# Altium schematic sheet Boost_Schem.SchDoc
size A4; SheetNumber: 1; SheetTotal: 1
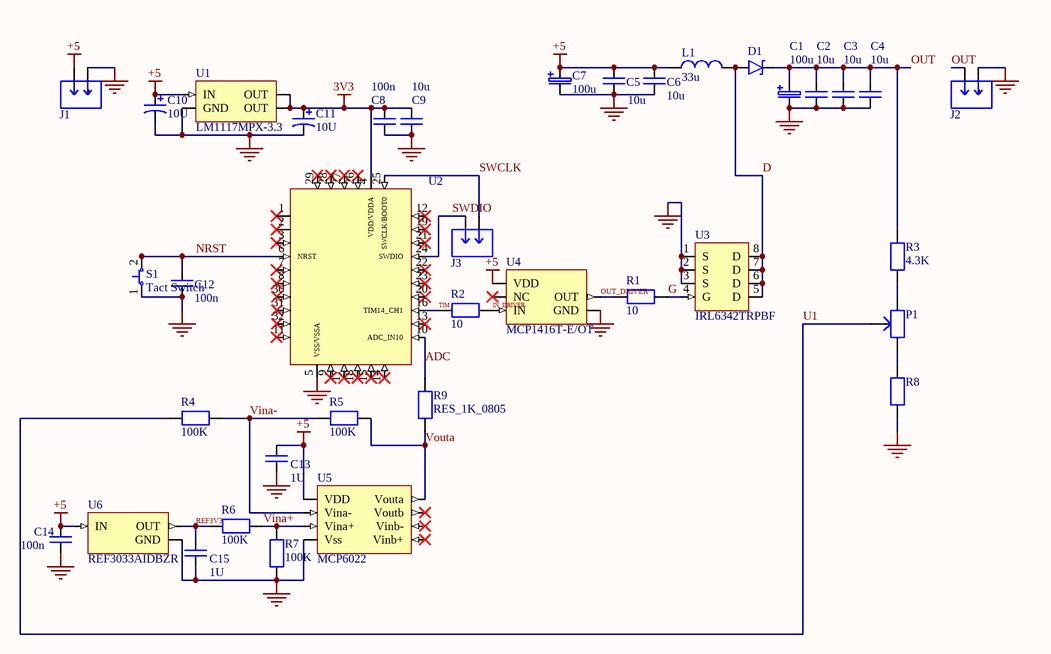
[diagram p0: Boost_Schem.SchDoc]

## Parts
C1  100u  [CAP_100UF_ALUM]
C2  10u  [CAP_10uF_1206_CER - duplicate]
C3  10u  [CAP_10uF_1206_CER - duplicate]
C4  10u  [CAP_10uF_1206_CER - duplicate]
C5  10u  [CAP_10uF_1206_CER - duplicate]
C6  10u  [CAP_10uF_1206_CER - duplicate]
C7  100u  [CAP_100UF_ALUM]
C8  100n  [CAP_100N_0805_CER]
C9  10u  [CAP_10uF_1206_CER - duplicate]
C10  10U  [CAP_10U_1206_TANTAL]
C11  10U  [CAP_10U_1206_TANTAL]
C12  100n  [CAP_100N_0805_CER]
C13  1U  [CAP_1U_0805_CER]
C14  100n  [CAP_100N_0805_CER]
C15  1U  [CAP_1U_0805_CER]
D1  SCHOTTKY_2A_60V  [SCHOTKY]  (value not drawn)
J1  LISTWA ZACISKOWA DO DRUKU  [ZACISK]  (value not drawn)
J2  LISTWA ZACISKOWA DO DRUKU  [ZACISK]  (value not drawn)
J3  ZŁĄCZE KOŁOWE  [SWD]  (value not drawn)
L1  33u  [CEWKA]
P1  2K  [POTENCJOMETR]  (value not drawn)
R1  10  [RES_10_0805]
R2  10  [RES_10_0805]
R3  4.3K  [RES_4K3_0805]
R4  100K  [RES_100K_0805]
R5  100K  [RES_100K_0805]
R6  100K  [RES_100K_0805]
R7  100K  [RES_100K_0805]
R8  51  [REZ_51_OHM_0805]  (value not drawn)
R9  RES_1K_0805  [RES_1K_0805]
S1  Tact Switch  [SWITCH]
U1  LM1117MPX-3.3  [LDO]
U2  STM32G030K8T6  [Quad32]  (value not drawn)
U3  IRL6342TRPBF  [TRANZYSTOR]
U4  MCP1416T-E/OT  [DRIVER]
U5  MCP6022  [WZMACNIACZ]
U6  REF3033AIDBZR  [REFF]

## Nets
3V3: C8.2 C9.1 C11.2 U1.2(OUT) U1.4(OUT) U2.4(VDD/VDDA)
+5: C5.1 C6.1 C7.2 C10.2 C13.2 C14.2 J1.1(+) L1.1 U1.3(IN) U4.2(VDD) U5.8(VDD) U6.1(IN)
GND: C1.1 C2.2 C3.2 C4.2 C5.2 C6.2 C7.1 C8.1 C9.2 C10.1 C11.1 C12.1 C13.1 C14.1 C15.1 J1.2(-) J2.2(-) R7.1 R8.1 S1.1 U1.1(GND) U2.5(VSS/VSSA) U3.1(S) U3.2(S) U3.3(S) U4.4(GND) U5.4(Vss) U6.3(GND)
ADC: R9.2 U2.10(ADC_IN10)
D: D1.1 L1.2 U3.5(D) U3.6(D) U3.7(D) U3.8(D)
G: R1.2 U3.4(G)
IN_DRIVER: R2.2 U4.3(IN)
NRST: C12.2 S1.2 U2.6(NRST)
OUT: C1.2 C2.1 C3.1 C4.1 D1.2 J2.1(+) R3.2
OUT_DRIVER: R1.1 U4.5(OUT)
REF3V3: C15.2 R6.1 U6.2(OUT)
SWCLK: J3.1(SWCLK) U2.25(SWCLK/BOOT0)
SWDIO: J3.2(SWDIO) U2.24(SWDIO)
TIM: R2.1 U2.16(TIM14_CH1)
U1: P1.2 R4.2
Vina+: R6.2 R7.2 U5.3(Vina+)
Vina-: R4.1 R5.2 U5.2(Vina-)
Vouta: R5.1 R9.1 U5.1(Vouta)
NetP1_1: P1.1 R3.1
NetP1_3: P1.3 R8.2

Not connected (* = marked no-connect by the designer): U2 1* 2* 3* 7* 8* 9* 11* 12* 13* 14* 15* 17* 18* 19* 20* 21* 22* 23* 26* 27* 28* 29* 30* 31* 32*; U4 1(NC)*; U5 5(Vinb+)* 6(Vinb-)* 7(Voutb)*

## Library data of the parts
C1 C7 = CAP_100UF_63V_ALUM: SMD Aluminum Electrolytic Capacitor SMD, D10xL10.2mm 100μF ±20% 63V 2000Hrs@105℃ 400mA 350mΩ; Manufacturer: Panasonic; Manufacturer Part Number: EEEFK1J101P; Manufacturer Lifecycle Status: ACTIVE; Part Series: FK; Dielectric Material: Aluminium; Dissipation Factor: 8%; Leakage Current: 63µA; Life (Hours): 2000hours; Polarity: Polar; Supplier: RS; Supplier Part Number: 7083623P; RoHS: Compliant; Category: Aluminum Electrolytic Capacitors; Stock: 1435; Value: 100µF; Case/Package: Radial; Contact Plating: Tin; Country of Origin: Japan, Malaysia; Diameter: 10mm; Export Control Classification Number (ECCN) Code: EAR99; ESR (Equivalent Series Resistance): 350mΩ; Height: 10.2mm; Height - Seated (Max): 10.4902mm; Harmonized Tariff Schedule (HTS) Code: 8532.22.00.20; Impedance: 350mΩ; Introduction Date: 2004-08-25; Lead Free: Lead Free; Length: 10.2mm; Lifecycle Status: Production; Material: Aluminium; Max Operating Temperature: 105°C; Min Operating Temperature: -55°C; Mounting Technology: Surface Mount; Pins: 2; Number of Terminals: 2; Packaging: Cut Tape; Radiation Hardening: No; REACH SVHC: Yes; Ripple Current: 400mA; Ripple Current (AC): 400mA; Schedule B: 8532220020, 8532220020|8532220020|8532220020|8532220020|8532220020|8532220020|8532220020|8532220020|8532220020|8532220020|8532220020|8532220020|8532220020|8532220020|8532220020|8532220020|8532220020|8532220020|8532220020|8532220020|8532220020|8532220020|8532220020|85; Termination: SMD/SMT; Tolerance: 20%; Voltage: 63V; Voltage Rating: 63V; Voltage Rating (AC): 63V; Voltage Rating (DC): 63V; Width: 10.3mm; ComponentLink1URL: https://datasheet.octopart.com:443/EEEFK1J101P-Panasonic-datasheet-62287436.pdf?src-supplier=Farnell; ComponentLink1Description: https://datasheet.octopart.com:443/EEEFK1J101P-Panasonic-datasheet-62287436.pdf?src-supplier=Farnell; ComponentLink2URL: https://datasheet.octopart.com:443/EEEFK1J101P-Panasonic-datasheet-5318435.pdf?src-supplier=Farnell; ComponentLink2Description: https://datasheet.octopart.com:443/EEEFK1J101P-Panasonic-datasheet-5318435.pdf?src-supplier=Farnell; ComponentLink3URL: https://datasheet.octopart.com:443/EEEFK1J101P-Panasonic-datasheet-5316599.pdf?src-supplier=Farnell; ComponentLink3Description: https://datasheet.octopart.com:443/EEEFK1J101P-Panasonic-datasheet-5316599.pdf?src-supplier=Farnell; ComponentLink4URL: https://datasheet.octopart.com:443/EEEFK1J101P-Panasonic-datasheet-5390910.pdf?src-supplier=Farnell; ComponentLink4Description: https://datasheet.octopart.com:443/EEEFK1J101P-Panasonic-datasheet-5390910.pdf?src-supplier=Farnell; ComponentLink5URL: https://datasheet.octopart.com:443/EEEFK1J101P-Panasonic-datasheet-7550061.pdf?src-supplier=Farnell; ComponentLink5Description: https://datasheet.octopart.com:443/EEEFK1J101P-Panasonic-datasheet-7550061.pdf?src-supplier=Farnell; ComponentLink6URL: https://datasheet.octopart.com:443/EEEFK1J101P-Panasonic-datasheet-1770.pdf?src-supplier=Farnell; ComponentLink6Description: https://datasheet.octopart.com:443/EEEFK1J101P-Panasonic-datasheet-1770.pdf?src-supplier=Farnell; ComponentLink7URL: https://datasheet.octopart.com:443/EEEFK1J101P-Panasonic-datasheet-1290.pdf?src-supplier=Farnell; ComponentLink7Description: https://datasheet.octopart.com:443/EEEFK1J101P-Panasonic-datasheet-1290.pdf?src-supplier=Farnell; ComponentLink8URL: https://datasheet.octopart.com:443/EEEFK1J101P-Panasonic-datasheet-2601.pdf?src-supplier=Farnell; ComponentLink8Description: https://datasheet.octopart.com:443/EEEFK1J101P-Panasonic-datasheet-2601.pdf?src-supplier=Farnell; ComponentLink9URL: https://datasheet.octopart.com:443/EEEFK1J101P-Panasonic-datasheet-122249.pdf?src-supplier=Farnell; ComponentLink9Description: https://datasheet.octopart.com:443/EEEFK1J101P-Panasonic-datasheet-122249.pdf?src-supplier=Farnell; ComponentLink10URL: https://datasheet.octopart.com:443/EEEFK1J101P-Panasonic-datasheet-4056.pdf?src-supplier=Farnell; ComponentLink10Description: https://datasheet.octopart.com:443/EEEFK1J101P-Panasonic-datasheet-4056.pdf?src-supplier=Farnell; ComponentLink11URL: https://datasheet.octopart.com:443/EEEFK1J101P-Panasonic-datasheet-169278531.pdf?src-supplier=IHS; ComponentLink11Description: https://datasheet.octopart.com:443/EEEFK1J101P-Panasonic-datasheet-169278531.pdf?src-supplier=IHS; ComponentLink12URL: https://datasheet.octopart.com:443/EEEFK1J101P-Panasonic-datasheet-8161.pdf?src-supplier=Newark; ComponentLink12Description: https://datasheet.octopart.com:443/EEEFK1J101P-Panasonic-datasheet-8161.pdf?src-supplier=Newark; ComponentLink13URL: https://datasheet.octopart.com:443/EEEFK1J101P-Panasonic-datasheet-61627622.pdf?src-supplier=Newark; ComponentLink13Description: https://datasheet.octopart.com:443/EEEFK1J101P-Panasonic-datasheet-61627622.pdf?src-supplier=Newark; ComponentLink14URL: https://datasheet.octopart.com:443/EEEFK1J101P-Panasonic-datasheet-8852369.pdf?src-supplier=Newark; ComponentLink14Description: https://datasheet.octopart.com:443/EEEFK1J101P-Panasonic-datasheet-8852369.pdf?src-supplier=Newark; ComponentLink15URL: https://datasheet.octopart.com:443/EEEFK1J101P-Panasonic-datasheet-8712906.pdf?src-supplier=Newark; ComponentLink15Description: https://datasheet.octopart.com:443/EEEFK1J101P-Panasonic-datasheet-8712906.pdf?src-supplier=Newark; ComponentLink16URL: https://datasheet.octopart.com:443/EEEFK1J101P-Panasonic-datasheet-13278598.pdf?src-supplier=Newark; ComponentLink16Description: https://datasheet.octopart.com:443/EEEFK1J101P-Panasonic-datasheet-13278598.pdf?src-supplier=Newark; ComponentLink17URL: https://datasheet.octopart.com:443/EEE-FK1J101P-Panasonic-datasheet-22087609.pdf?src-supplier=Newark; ComponentLink17Description: https://datasheet.octopart.com:443/EEE-FK1J101P-Panasonic-datasheet-22087609.pdf?src-supplier=Newark; ComponentLink18URL: https://datasheet.octopart.com:443/EEEFK1J101P-Panasonic-datasheet-11546739.pdf?src-supplier=Electro+Sonic; ComponentLink18Description: https://datasheet.octopart.com:443/EEEFK1J101P-Panasonic-datasheet-11546739.pdf?src-supplier=Electro+Sonic; ComponentLink19URL: https://datasheet.octopart.com:443/EEEFK1J101P-Panasonic-datasheet-13266987.pdf?src-supplier=RS+(Formerly+Allied+Electronics); ComponentLink19Description: https://datasheet.octopart.com:443/EEEFK1J101P-Panasonic-datasheet-13266987.pdf?src-supplier=RS+(Formerly+Allied+Electronics); ComponentLink20URL: https://datasheet.octopart.com:443/EEE-FK1J101P-Panasonic-datasheet-150469824.pdf?src-supplier=Master+Electronics; ComponentLink20Description: https://datasheet.octopart.com:443/EEE-FK1J101P-Panasonic-datasheet-150469824.pdf?src-supplier=Master+Electronics; ComponentLink21URL: https://datasheet.octopart.com:443/EEEFK1J101P-Panasonic-datasheet-8854493.pdf?src-supplier=Future+Electronics; ComponentLink21Description: https://datasheet.octopart.com:443/EEEFK1J101P-Panasonic-datasheet-8854493.pdf?src-supplier=Future+Electronics; ComponentLink22URL: https://datasheet.octopart.com:443/EEEFK1J101P-Panasonic-datasheet-8711795.pdf?src-supplier=Future+Electronics; ComponentLink22Description: https://datasheet.octopart.com:443/EEEFK1J101P-Panasonic-datasheet-8711795.pdf?src-supplier=Future+Electronics; ComponentLink23URL: https://datasheet.octopart.com:443/EEEFK1J101P-Panasonic-datasheet-5313801.pdf?src-supplier=Future+Electronics; ComponentLink23Description: https://datasheet.octopart.com:443/EEEFK1J101P-Panasonic-datasheet-5313801.pdf?src-supplier=Future+Electronics; ComponentLink24URL: https://datasheet.octopart.com:443/EEEFK1J101P-Panasonic-datasheet-7555708.pdf?src-supplier=Jameco; ComponentLink24Description: https://datasheet.octopart.com:443/EEEFK1J101P-Panasonic-datasheet-7555708.pdf?src-supplier=Jameco; ComponentLink25URL: https://sigma.octopart.com:443/150570760/technical_drawing/Panasonic-EEEFK1J101P.pdf?src-supplier=Panasonic+SCT; ComponentLink25Description: https://sigma.octopart.com:443/150570760/technical_drawing/Panasonic-EEEFK1J101P.pdf?src-supplier=Panasonic+SCT; ComponentLink26URL: https://datasheet.octopart.com:443/EEEFK1J101P-Panasonic-datasheet-136531309.pdf?src-supplier=TME; ComponentLink26Description: https://datasheet.octopart.com:443/EEEFK1J101P-Panasonic-datasheet-136531309.pdf?src-supplier=TME
C2-C4 C6 C9 = CAP_10uF_1206_CER: CAP CER 10UF 50V X7R 1206; Manufacturer: Samsung Electro-Mechanics; Manufacturer Part Number: CL31B106KBHNNNE; Value: 10µF; Dielectric Material: Ceramic; Tolerance: 10%; Supplier: Avnet; Supplier Part Number: CL31B106KBHNNNE; RoHS: Compliant; Category: Ceramic Capacitors; Stock: 874000; Pricing: 2000=0,04677, 4000=0,04637, 8000=0,04557, 16000=0,04478, 32000=0,04398 (USD); Case/Package: 1206; Case Code (Imperial): 1206; Case Code (Metric): 3216; China RoHS: Compliant; Country of Origin: Mainland China, Philippines, South Korea; Dielectric: X7R; Export Control Classification Number (ECCN) Code: EAR99; Height: 1.8mm; Harmonized Tariff Schedule (HTS) Code: 8532.24.00.20; Introduction Date: 2014-09-18; Lead Free: Lead Free; Length: 3.2mm; Lifecycle Status: Production; Material: Ceramic; Max Operating Temperature: 125°C; Min Operating Temperature: -55°C; Mounting Technology: Surface Mount; Number of Terminals: 2; Packaging: Tape & Reel (TR); REACH SVHC: Yes; Schedule B: 8532240020, 8532240020|8532240020|8532240020|8532240020|8532240020; Thickness: 1.8034mm; Voltage Rating: 50V; Voltage Rating (DC): 50V; Width: 1.6mm; ComponentLink1URL: https://datasheet.octopart.com:443/CL31B106KBHNNNE-Samsung-Electro-Mechanics-datasheet-137256395.pdf?src-supplier=Upverter; ComponentLink1Description: https://datasheet.octopart.com:443/CL31B106KBHNNNE-Samsung-Electro-Mechanics-datasheet-137256395.pdf?src-supplier=Upverter; ComponentLink2URL: https://datasheet.octopart.com:443/CL31B106KBHNNNE-Samsung-Electro-Mechanics-datasheet-149066874.pdf?src-supplier=Future+Electronics; ComponentLink2Description: https://datasheet.octopart.com:443/CL31B106KBHNNNE-Samsung-Electro-Mechanics-datasheet-149066874.pdf?src-supplier=Future+Electronics; ComponentLink3URL: https://datasheet.octopart.com:443/CL31B106KBHNNNE-Samsung-Electro-Mechanics-datasheet-67374631.pdf?src-supplier=Future+Electronics; ComponentLink3Description: https://datasheet.octopart.com:443/CL31B106KBHNNNE-Samsung-Electro-Mechanics-datasheet-67374631.pdf?src-supplier=Future+Electronics; ComponentLink4URL: https://datasheet.octopart.com:443/CL31B106KBHNNNE-Samsung-Electro-Mechanics-datasheet-136482622.pdf?src-supplier=Newark; ComponentLink4Description: https://datasheet.octopart.com:443/CL31B106KBHNNNE-Samsung-Electro-Mechanics-datasheet-136482622.pdf?src-supplier=Newark; ComponentLink5URL: https://datasheet.octopart.com/CL31B106KBHNNNE-Samsung-Electro-Mechanics-datasheet-97040617.pdf; ComponentLink5Description: https://datasheet.octopart.com/CL31B106KBHNNNE-Samsung-Electro-Mechanics-datasheet-97040617.pdf; ComponentLink6URL: https://datasheet.octopart.com/CL31B106KBHNNNE-Samsung-Electro-Mechanics-datasheet-8324245.pdf; ComponentLink6Description: https://datasheet.octopart.com/CL31B106KBHNNNE-Samsung-Electro-Mechanics-datasheet-8324245.pdf; ComponentLink7URL: https://datasheet.octopart.com:443/CL31B106KBHNNNE-Samsung-Electro-Mechanics-datasheet-110617700.pdf?src-supplier=LCSC; ComponentLink7Description: https://datasheet.octopart.com:443/CL31B106KBHNNNE-Samsung-Electro-Mechanics-datasheet-110617700.pdf?src-supplier=LCSC; ComponentLink8URL: https://datasheet.octopart.com:443/CL31B106KBHNNNE-Samsung-datasheet-59220082.pdf?src-supplier=TME; ComponentLink8Description: https://datasheet.octopart.com:443/CL31B106KBHNNNE-Samsung-datasheet-59220082.pdf?src-supplier=TME
C5 = CAP_10uF_1206_CER: Manufacturer: Samsung Electro-Mechanics; Manufacturer Part Number: CL31B106KBHNNNE; Value: 10µF; Dielectric: X7R; Dielectric Material: Ceramic; Tolerance: 10%; Voltage Rating: 50V; Supplier: Avnet; Supplier Part Number: CL31B106KBHNNNE; RoHS: Compliant; Category: Ceramic Capacitors; Stock: 874000; Pricing: 2000=0,04677, 4000=0,04637, 8000=0,04557, 16000=0,04478, 32000=0,04398 (USD); Case/Package: 1206; Case Code (Imperial): 1206; Case Code (Metric): 3216; China RoHS: Compliant; Country of Origin: Mainland China, Philippines, South Korea; Export Control Classification Number (ECCN) Code: EAR99; Height: 1.8mm; Harmonized Tariff Schedule (HTS) Code: 8532.24.00.20; Introduction Date: 2014-09-18; Lead Free: Lead Free; Length: 3.2mm; Lifecycle Status: Production; Material: Ceramic; Max Operating Temperature: 125°C; Min Operating Temperature: -55°C; Mounting Technology: Surface Mount; Number of Terminals: 2; Packaging: Tape & Reel (TR); REACH SVHC: Yes; Schedule B: 8532240020, 8532240020|8532240020|8532240020|8532240020|8532240020; Thickness: 1.8034mm; Voltage Rating (DC): 50V; Width: 1.6mm; ComponentLink1URL: https://datasheet.octopart.com:443/CL31B106KBHNNNE-Samsung-Electro-Mechanics-datasheet-137256395.pdf?src-supplier=Upverter; ComponentLink1Description: https://datasheet.octopart.com:443/CL31B106KBHNNNE-Samsung-Electro-Mechanics-datasheet-137256395.pdf?src-supplier=Upverter; ComponentLink2URL: https://datasheet.octopart.com:443/CL31B106KBHNNNE-Samsung-Electro-Mechanics-datasheet-149066874.pdf?src-supplier=Future+Electronics; ComponentLink2Description: https://datasheet.octopart.com:443/CL31B106KBHNNNE-Samsung-Electro-Mechanics-datasheet-149066874.pdf?src-supplier=Future+Electronics; ComponentLink3URL: https://datasheet.octopart.com:443/CL31B106KBHNNNE-Samsung-Electro-Mechanics-datasheet-67374631.pdf?src-supplier=Future+Electronics; ComponentLink3Description: https://datasheet.octopart.com:443/CL31B106KBHNNNE-Samsung-Electro-Mechanics-datasheet-67374631.pdf?src-supplier=Future+Electronics; ComponentLink4URL: https://datasheet.octopart.com:443/CL31B106KBHNNNE-Samsung-Electro-Mechanics-datasheet-136482622.pdf?src-supplier=Newark; ComponentLink4Description: https://datasheet.octopart.com:443/CL31B106KBHNNNE-Samsung-Electro-Mechanics-datasheet-136482622.pdf?src-supplier=Newark; ComponentLink5URL: https://datasheet.octopart.com/CL31B106KBHNNNE-Samsung-Electro-Mechanics-datasheet-97040617.pdf; ComponentLink5Description: https://datasheet.octopart.com/CL31B106KBHNNNE-Samsung-Electro-Mechanics-datasheet-97040617.pdf; ComponentLink6URL: https://datasheet.octopart.com/CL31B106KBHNNNE-Samsung-Electro-Mechanics-datasheet-8324245.pdf; ComponentLink6Description: https://datasheet.octopart.com/CL31B106KBHNNNE-Samsung-Electro-Mechanics-datasheet-8324245.pdf; ComponentLink7URL: https://datasheet.octopart.com:443/CL31B106KBHNNNE-Samsung-Electro-Mechanics-datasheet-110617700.pdf?src-supplier=LCSC; ComponentLink7Description: https://datasheet.octopart.com:443/CL31B106KBHNNNE-Samsung-Electro-Mechanics-datasheet-110617700.pdf?src-supplier=LCSC; ComponentLink8URL: https://datasheet.octopart.com:443/CL31B106KBHNNNE-Samsung-datasheet-59220082.pdf?src-supplier=TME; ComponentLink8Description: https://datasheet.octopart.com:443/CL31B106KBHNNNE-Samsung-datasheet-59220082.pdf?src-supplier=TME
C8 C12 C14 = CAP_100nF_0805_CER
C10 C11 = CAP_10uF_0805_TANTALUM
C13 C15 = CAP_1uF_0805_CER
D1 = SCHOTTKY_2A_60V: Dioda: prostownicza Schottky; SMA; SMD; 60V; 2A; rolka,taśma; Manufacturer: STMicroelectronics; Manufacturer Part Number: STPS2L60A; Element Configuration: Single; Forward Voltage: 550mV; Max Forward Surge Current (Ifsm): 75A; Max Junction Temperature (Tj): 150°C; Max Reverse Leakage Current: 100µA; Number of Elements: 1; Polarity: Standard; Supplier: RS; Supplier Part Number: 249218P; RoHS: Compliant; Category: Schottky Diodes; Stock: 4660; Average Rectified Current: 2A; Case/Package: SMA; China RoHS: Non-Compliant; Contact Plating: Tin; Current Rating: 2A; Forward Current: 2A; Height: 2.65mm; Lead Free: Lead Free; Length: 4.6mm; Lifecycle Status: Production; Max Operating Temperature: 150°C; Max Output current: 2A; Max Repetitive Reverse Voltage (Vrrm): 60V; Max Reverse Voltage (DC): 60V; Max Surge Current: 75A; Min Operating Temperature: -65°C; Mounting Technology: Surface Mount; Pins: 2; Number of Terminals: 2; Output Current: 2A; Packaging: Tape and Reel; Peak Non-Repetitive Surge Current: 75A; Peak Reverse Current: 100µA; Radiation Hardening: No; REACH SVHC: No; Reverse Standoff Voltage: 60V; Schedule B: 8541100080, 8541100080|8541100080|8541100080|8541100080|8541100080, 8541100080|8541100080|8541100080|8541100080|8541100080|8541100080, 8541100080|8541100080|8541100080|8541100080|8541100080|8541100080|8541100080|8541100080|8541100080|8541100080|8541100080|8541100080|8541100080|8541100080|8541100080|8541100080|8541100080|8541100080|8541100080|8541100080|8541100080|8541100080|8541100080|85; Voltage Rating (DC): 60V; Weight: 4.535924g; Width: 2.95mm; ComponentLink1URL: https://datasheet.octopart.com:443/STPS2L60A-STMicroelectronics-datasheet-10540977.pdf?src-supplier=element14+APAC; ComponentLink1Description: https://datasheet.octopart.com:443/STPS2L60A-STMicroelectronics-datasheet-10540977.pdf?src-supplier=element14+APAC; ComponentLink2URL: https://datasheet.octopart.com:443/STPS2L60A-STMicroelectronics-datasheet-62337125.pdf?src-supplier=Newark; ComponentLink2Description: https://datasheet.octopart.com:443/STPS2L60A-STMicroelectronics-datasheet-62337125.pdf?src-supplier=Newark; ComponentLink3URL: https://datasheet.octopart.com:443/STPS2L60A-STMicroelectronics-datasheet-633754.pdf?src-supplier=element14; ComponentLink3Description: https://datasheet.octopart.com:443/STPS2L60A-STMicroelectronics-datasheet-633754.pdf?src-supplier=element14; ComponentLink4URL: https://datasheet.octopart.com:443/STPS2L60A-STMicroelectronics-datasheet-8474236.pdf?src-supplier=Farnell; ComponentLink4Description: https://datasheet.octopart.com:443/STPS2L60A-STMicroelectronics-datasheet-8474236.pdf?src-supplier=Farnell; ComponentLink5URL: https://datasheet.octopart.com:443/STPS2L60A-STMicroelectronics-datasheet-7700.pdf?src-supplier=DigiKey; ComponentLink5Description: https://datasheet.octopart.com:443/STPS2L60A-STMicroelectronics-datasheet-7700.pdf?src-supplier=DigiKey; ComponentLink6URL: https://datasheet.octopart.com:443/STPS2L60A-STMicroelectronics-datasheet-136784893.pdf?src-supplier=TME; ComponentLink6Description: https://datasheet.octopart.com:443/STPS2L60A-STMicroelectronics-datasheet-136784893.pdf?src-supplier=TME; ComponentLink7URL: https://datasheet.octopart.com:443/STPS2L60A-STMicroelectronics-datasheet-107242832.pdf?src-supplier=TME; ComponentLink7Description: https://datasheet.octopart.com:443/STPS2L60A-STMicroelectronics-datasheet-107242832.pdf?src-supplier=TME; ComponentLink8URL: https://datasheet.octopart.com:443/STPS2L60A-STMicroelectronics-datasheet-14054748.pdf?src-supplier=iiiC; ComponentLink8Description: https://datasheet.octopart.com:443/STPS2L60A-STMicroelectronics-datasheet-14054748.pdf?src-supplier=iiiC; ComponentLink9URL: https://datasheet.octopart.com:443/STPS2L60A-STMicroelectronics-datasheet-9806417.pdf?src-supplier=RS+(Formerly+Allied+Electronics); ComponentLink9Description: https://datasheet.octopart.com:443/STPS2L60A-STMicroelectronics-datasheet-9806417.pdf?src-supplier=RS+(Formerly+Allied+Electronics)
J1 J2 = ZACISK
J3 = ZŁĄCZE KOŁOWE: Złącze: kołkowe; listwa kołkowa; męskie; PIN: 2; THT; BERGSTIK; 1x2
L1 = IND_33uH_3.22A: Dławik: drutowy; SMD; 32,01uH; Ipracy: 3,22A; R: 60mΩ; ±20%; Manufacturer: Eaton; Manufacturer Part Number: DRA127-330-R; Core Material: Ferrite; Current Rating: 3.22A; Value: 32.01µH; Number of Circuits: 1; Saturation Current: 6.22A; Self Resonant Frequency: 100kHz; Shielding: Yes; Supplier: DigiKey; Supplier Part Number: 283-3593-1-ND; RoHS: Compliant; Category: Fixed Inductors; Stock: 194; Pricing: 1=2,18, 10=1,796, 25=1,662, 50=1,5668, 100=1,4773 (USD); Case/Package: Nonstandard; Composition: Wirewound; Country of Origin: Philippines; DC Resistance (DCR): 60mΩ; Depth: 12.5mm; Export Control Classification Number (ECCN) Code: EAR99; Height: 8mm; Height - Seated (Max): 8.001mm; Harmonized Tariff Schedule (HTS) Code: 8504.50.80.00; Inductance Tolerance: 20%; Introduction Date: 2006-11-16; Lead Free: Lead Free; Lead Pitch: 7.5mm; Length: 12.5mm; Lifecycle Status: Production; Max Current Rating: 3.22A; Max DC Current: 3.22A; Max Operating Temperature: 165°C; Military Standard: Not; Min Operating Temperature: -40°C; Mounting Technology: Surface Mount; Pins: 2; Number of Terminals: 2; Packaging: Cut Tape; Radiation Hardening: No; Ratings: AEC-Q200; REACH SVHC: Yes; RMS Current (Irms): 3.22A; Schedule B: 8504500000, 8504500000|8504500000|8504500000|8504500000|8504500000|8504500000|8504500000|8504500000|8504500000|8504500000|8504500000|8504500000|8504500000|8504500000|8504500000|8504500000|8504500000|8504500000|8504500000|8504500000|8504500000|8504500000|8504500000|85; Termination: SMD/SMT; Test Frequency: 100kHz; Tolerance: 20%; Weight: 453.59237mg; Width: 12.5mm; ComponentLink1URL: https://datasheet.octopart.com:443/DRA127-330-R-Eaton-datasheet-137317803.pdf?src-supplier=Master+Electronics; ComponentLink1Description: https://datasheet.octopart.com:443/DRA127-330-R-Eaton-datasheet-137317803.pdf?src-supplier=Master+Electronics; ComponentLink2URL: https://datasheet.octopart.com:443/DRA127-330-R-Eaton-datasheet-613698.pdf?src-supplier=Master+Electronics; ComponentLink2Description: https://datasheet.octopart.com:443/DRA127-330-R-Eaton-datasheet-613698.pdf?src-supplier=Master+Electronics; ComponentLink3URL: https://datasheet.octopart.com:443/DRA127-330-R-Eaton-datasheet-62296927.pdf?src-supplier=Master+Electronics; ComponentLink3Description: https://datasheet.octopart.com:443/DRA127-330-R-Eaton-datasheet-62296927.pdf?src-supplier=Master+Electronics; ComponentLink4URL: https://datasheet.octopart.com:443/DRA127-330-R-Eaton-datasheet-137317933.pdf?src-supplier=Master+Electronics; ComponentLink4Description: https://datasheet.octopart.com:443/DRA127-330-R-Eaton-datasheet-137317933.pdf?src-supplier=Master+Electronics; ComponentLink5URL: https://datasheet.octopart.com:443/DRA127-330-R-Cooper-Industries-datasheet-12525441.pdf?src-supplier=Sager+Electronics; ComponentLink5Description: https://datasheet.octopart.com:443/DRA127-330-R-Cooper-Industries-datasheet-12525441.pdf?src-supplier=Sager+Electronics; ComponentLink6URL: https://datasheet.octopart.com:443/DRA127-330-R-Cooper-Bussmann-datasheet-180236337.pdf?src-supplier=IHS; ComponentLink6Description: https://datasheet.octopart.com:443/DRA127-330-R-Cooper-Bussmann-datasheet-180236337.pdf?src-supplier=IHS
P1 = POTENCJOMETR
R1 R2 = RES_10_0805: Rezystor: thick film; SMD; 0805; 10Ω; 250mW; ±5%; 150V; -55÷125°C
R3 = RES_4.3K_0805: Res Thin Film 0805 4.3K Ohm 0.1% 0.125W ±25ppm/°C Molded SMD Punched Carrier T/R; Manufacturer: Panasonic; Manufacturer Part Number: ERA6AEB432V; Manufacturer Lifecycle Status: ACTIVE; Part Series: Thin Film Chip Resistors, High Reliability Type; Max Power Dissipation: 125mW; Value: 4.3kΩ; Voltage Rating: 100V; Supplier: Farnell; Supplier Part Number: 1670236; RoHS: Compliant; Category: Chip SMD Resistors; Stock: 2679; Case/Package: 0805; Case Code (Imperial): 0805; China RoHS: Non-Compliant; Composition: Thin Film; Contact Plating: Tin; Country of Origin: Japan; Depth: 1.25mm; Export Control Classification Number (ECCN) Code: EAR99; Features: Automotive AEC-Q200; Height: 500µm; Harmonized Tariff Schedule (HTS) Code: 8533.21.00.30; Introduction Date: 2006-05-29; Lead Free: Lead Free; Length: 2mm; Lifecycle Status: Production; Max Operating Temperature: 155°C; Military Standard: Not; Min Operating Temperature: -55°C; Mounting Technology: Surface Mount; Pins: 2; Number of Terminals: 2; Number of Terminations: 2; Packaging: Cut Tape; Power Dissipation: 125mW; Power Rating: 125mW; Radiation Hardening: No; REACH SVHC: Yes; Schedule B: 8533210045, 8533210045|8533210045, 8533210045|8533210045|8533210045, 8533210045|8533210045|8533210045|8533210045; Temperature Coefficient: 25ppm/°C; Termination: SMD/SMT; Tolerance: 0.1%; Voltage Rating (DC): 100V; Weight: 5.499807mg; Width: 1.25mm; Working Voltage: 100V; ComponentLink1URL: https://datasheet.octopart.com:443/ERA6AEB432V-Panasonic-datasheet-181959660.pdf?src-supplier=IHS; ComponentLink1Description: https://datasheet.octopart.com:443/ERA6AEB432V-Panasonic-datasheet-181959660.pdf?src-supplier=IHS; ComponentLink2URL: https://datasheet.octopart.com/ERA6AEB432V-Panasonic-datasheet-62287448.pdf; ComponentLink2Description: https://datasheet.octopart.com/ERA6AEB432V-Panasonic-datasheet-62287448.pdf; ComponentLink3URL: https://datasheet.octopart.com/ERA6AEB432V-Panasonic-datasheet-78375410.pdf; ComponentLink3Description: https://datasheet.octopart.com/ERA6AEB432V-Panasonic-datasheet-78375410.pdf; ComponentLink4URL: https://datasheet.octopart.com:443/ERA6AEB432V-Panasonic-datasheet-8367715.pdf?src-supplier=Newark; ComponentLink4Description: https://datasheet.octopart.com:443/ERA6AEB432V-Panasonic-datasheet-8367715.pdf?src-supplier=Newark; ComponentLink5URL: https://datasheet.octopart.com:443/ERA6AEB432V-Panasonic-datasheet-136531316.pdf?src-supplier=Newark; ComponentLink5Description: https://datasheet.octopart.com:443/ERA6AEB432V-Panasonic-datasheet-136531316.pdf?src-supplier=Newark; ComponentLink6URL: https://datasheet.octopart.com:443/ERA-6AEB432V-Panasonic-datasheet-118567.pdf?src-supplier=element14; ComponentLink6Description: https://datasheet.octopart.com:443/ERA-6AEB432V-Panasonic-datasheet-118567.pdf?src-supplier=element14; ComponentLink7URL: https://datasheet.octopart.com:443/ERA6AEB432V-Panasonic-datasheet-61114971.pdf?src-supplier=Future+Electronics; ComponentLink7Description: https://datasheet.octopart.com:443/ERA6AEB432V-Panasonic-datasheet-61114971.pdf?src-supplier=Future+Electronics; ComponentLink8URL: https://datasheet.octopart.com:443/ERA-6AEB432V-Panasonic-datasheet-12510007.pdf?src-supplier=Future+Electronics; ComponentLink8Description: https://datasheet.octopart.com:443/ERA-6AEB432V-Panasonic-datasheet-12510007.pdf?src-supplier=Future+Electronics; ComponentLink9URL: https://datasheet.octopart.com:443/ERA-6AEB432V-Panasonic-datasheet-11763931.pdf?src-supplier=Future+Electronics; ComponentLink9Description: https://datasheet.octopart.com:443/ERA-6AEB432V-Panasonic-datasheet-11763931.pdf?src-supplier=Future+Electronics; ComponentLink10URL: https://datasheet.octopart.com:443/ERA-6AEB432V-Panasonic-datasheet-5392808.pdf?src-supplier=Future+Electronics; ComponentLink10Description: https://datasheet.octopart.com:443/ERA-6AEB432V-Panasonic-datasheet-5392808.pdf?src-supplier=Future+Electronics; ComponentLink11URL: https://datasheet.octopart.com:443/ERA-6AEB432V-Panasonic-datasheet-154766165.pdf?src-supplier=Master+Electronics; ComponentLink11Description: https://datasheet.octopart.com:443/ERA-6AEB432V-Panasonic-datasheet-154766165.pdf?src-supplier=Master+Electronics; ComponentLink12URL: https://datasheet.octopart.com:443/ERA-6AEB432V-Panasonic-datasheet-10840895.pdf?src-supplier=Arrow+Electronics; ComponentLink12Description: https://datasheet.octopart.com:443/ERA-6AEB432V-Panasonic-datasheet-10840895.pdf?src-supplier=Arrow+Electronics; ComponentLink13URL: https://datasheet.octopart.com:443/ERA-6AEB432V-Panasonic-datasheet-13266200.pdf?src-supplier=Electro+Sonic; ComponentLink13Description: https://datasheet.octopart.com:443/ERA-6AEB432V-Panasonic-datasheet-13266200.pdf?src-supplier=Electro+Sonic; ComponentLink14URL: https://datasheet.octopart.com:443/ERA-6AEB432V-Panasonic-datasheet-33006989.pdf?src-supplier=Electro+Sonic; ComponentLink14Description: https://datasheet.octopart.com:443/ERA-6AEB432V-Panasonic-datasheet-33006989.pdf?src-supplier=Electro+Sonic; ComponentLink15URL: https://datasheet.octopart.com:443/ERA-6AEB432V-Panasonic-datasheet-46744048.pdf?src-supplier=Electro+Sonic; ComponentLink15Description: https://datasheet.octopart.com:443/ERA-6AEB432V-Panasonic-datasheet-46744048.pdf?src-supplier=Electro+Sonic; ComponentLink16URL: https://datasheet.octopart.com:443/ERA6AEB432V-Panasonic-datasheet-188913046.pdf?src-supplier=TME; ComponentLink16Description: https://datasheet.octopart.com:443/ERA6AEB432V-Panasonic-datasheet-188913046.pdf?src-supplier=TME; ComponentLink17URL: https://datasheet.octopart.com:443/ERA6AEB432V-Panasonic-datasheet-182736513.pdf?src-supplier=JRH+Electronics; ComponentLink17Description: https://datasheet.octopart.com:443/ERA6AEB432V-Panasonic-datasheet-182736513.pdf?src-supplier=JRH+Electronics; ComponentLink18URL: https://sigma.octopart.com:443/150570796/technical_drawing/Panasonic-ERA6AEB432V.pdf?src-supplier=Panasonic+SCT; ComponentLink18Description: https://sigma.octopart.com:443/150570796/technical_drawing/Panasonic-ERA6AEB432V.pdf?src-supplier=Panasonic+SCT; ComponentLink19URL: https://datasheet.octopart.com:443/ERA6AEB432V-Panasonic-datasheet-138783076.pdf?src-supplier=Burklin+Elektronik; ComponentLink19Description: https://datasheet.octopart.com:443/ERA6AEB432V-Panasonic-datasheet-138783076.pdf?src-supplier=Burklin+Elektronik; ComponentLink20URL: https://datasheet.octopart.com:443/ERA6AEB432V-Panasonic---ECG-datasheet-15994758.pdf?src-supplier=Farnell; ComponentLink20Description: https://datasheet.octopart.com:443/ERA6AEB432V-Panasonic---ECG-datasheet-15994758.pdf?src-supplier=Farnell
R4 R5 R7 = RES_100K_0805: Rezystor: thin film; precyzyjny; SMD; 0603; 50kΩ; 0,1W; ±0,1%; AR
R6 = RES_100K_0805
R8 = RES_51_0805
U5 = MCP6022: IC: wzmacniacz operacyjny; 10MHz; Ch: 2; 2,5÷5,5VDC; SO8; tuba